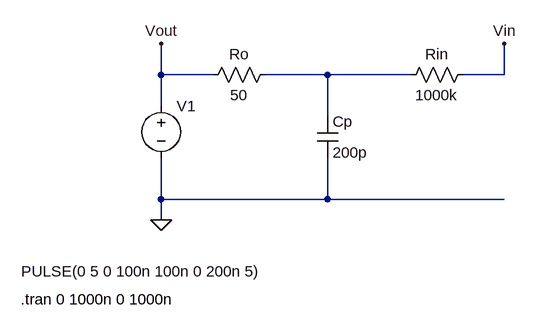
[diagram p0: schematic cap_parasita.asc]
cap_parasita.asc, the LTspice schematic file:
Version 4
SHEET 1 880 680
WIRE 48 80 48 32
WIRE 128 80 48 80
WIRE 304 80 208 80
WIRE 432 80 304 80
WIRE 576 80 576 32
WIRE 576 80 512 80
WIRE 48 128 48 80
WIRE 304 144 304 80
WIRE 48 272 48 208
WIRE 304 272 304 208
WIRE 304 272 48 272
WIRE 576 272 304 272
WIRE 48 304 48 272
FLAG 48 304 0
FLAG 48 32 Vout
FLAG 576 32 Vin
SYMBOL res 224 64 R90
WINDOW 0 0 56 VBottom 2
WINDOW 3 32 56 VTop 2
SYMATTR InstName Ro
SYMATTR Value 50
SYMBOL res 528 64 R90
WINDOW 0 0 56 VBottom 2
WINDOW 3 32 56 VTop 2
SYMATTR InstName Rin
SYMATTR Value 1000k
SYMBOL cap 288 144 R0
SYMATTR InstName Cp
SYMATTR Value 200p
SYMBOL voltage 48 112 R0
WINDOW 3 -215 271 Left 2
WINDOW 123 0 0 Left 0
WINDOW 39 0 0 Left 0
SYMATTR InstName V1
SYMATTR Value PULSE(0 5 0 100n 100n 0 200n 5)
TEXT -168 426 Left 2 !.tran 0 1000n 0 1000n

The netlist it stands for:
* cap_parasita.asc
Ro N001 Vout 50
Rin Vin N001 1000k
Cp N001 0 200p
V1 Vout 0 PULSE(0 5 0 100n 100n 0 200n 5)
.tran 0 1000n 0 1000n
.backanno
.end